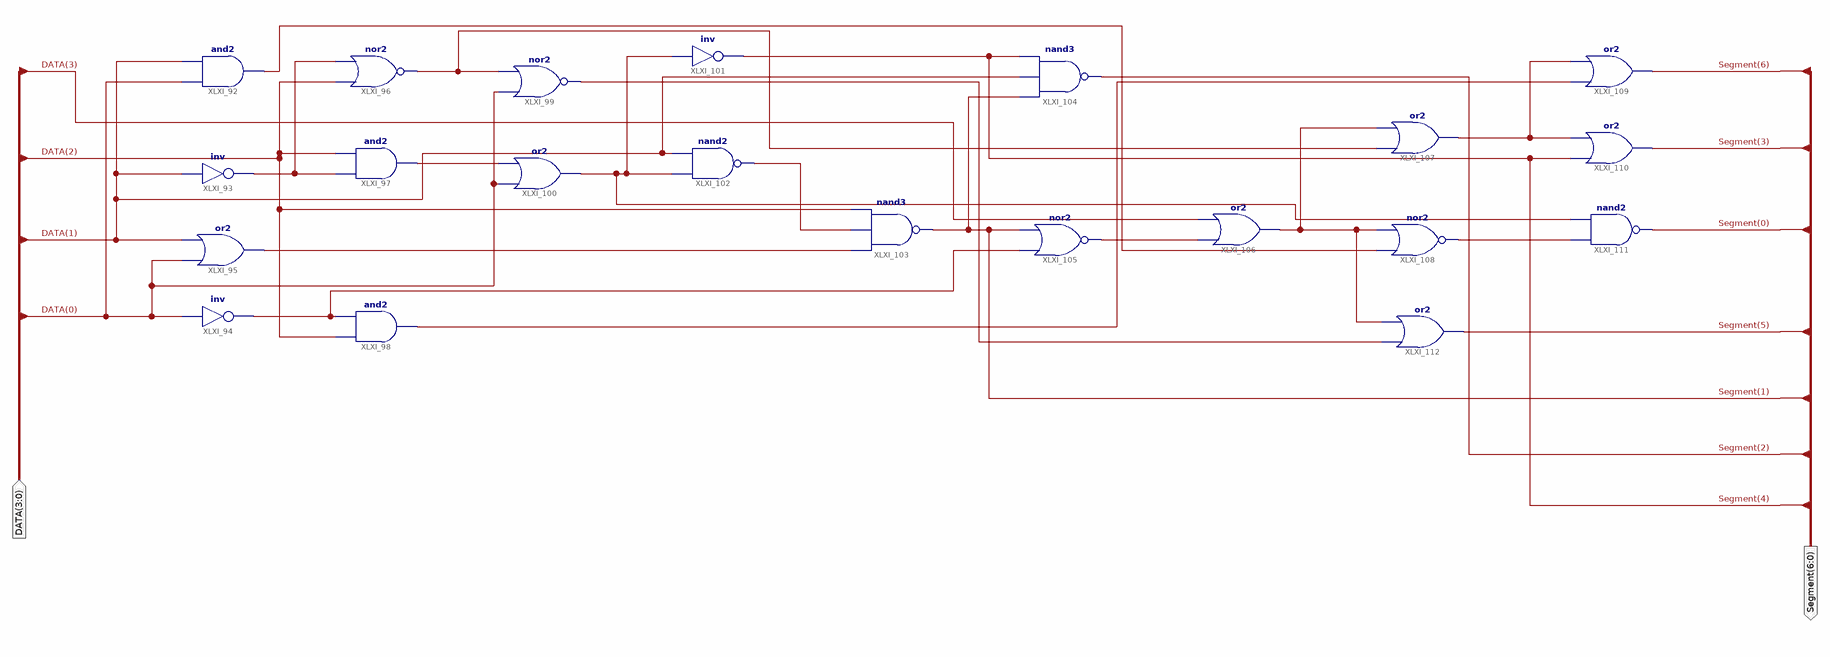
[diagram p0: schematic sheet 1]
// Xilinx ISE schematic ssd1d09b.sch (spartan6) as structural Verilog: 21 symbols, 2 ports
module ssd1d09b (
  input  [3:0] DATA,
  output [6:0] Segment
);

  wire XLXN_109, XLXN_111, XLXN_113, XLXN_114, XLXN_117, XLXN_118, XLXN_119, XLXN_125, XLXN_129, XLXN_130,
       XLXN_131, XLXN_132, XLXN_134, XLXN_135;

  and XLXI_92 (XLXN_129, DATA[0], DATA[1]);
  not XLXI_93 (XLXN_109, DATA[1]);
  not XLXI_94 (XLXN_111, DATA[0]);
  or XLXI_95 (XLXN_118, DATA[0], DATA[1]);
  nor XLXI_96 (XLXN_113, DATA[2], XLXN_109);
  and XLXI_97 (XLXN_114, XLXN_109, DATA[2]);
  and XLXI_98 (XLXN_135, DATA[2], XLXN_111);
  nor XLXI_99 (XLXN_131, DATA[0], XLXN_113);
  or XLXI_100 (XLXN_117, DATA[0], XLXN_114);
  not XLXI_101 (Segment[4], XLXN_117);
  nand XLXI_102 (XLXN_119, XLXN_117, DATA[1]);
  nand XLXI_103 (Segment[1], XLXN_118, XLXN_119, DATA[2]);
  nand XLXI_104 (Segment[2], Segment[1], DATA[1], Segment[4]);
  nor XLXI_105 (XLXN_125, XLXN_111, Segment[1]);
  or XLXI_106 (XLXN_130, XLXN_125, DATA[3]);
  or XLXI_107 (XLXN_134, XLXN_113, XLXN_130);
  nor XLXI_108 (XLXN_132, XLXN_129, XLXN_130);
  or XLXI_109 (Segment[6], XLXN_135, XLXN_134);
  or XLXI_110 (Segment[3], Segment[4], XLXN_134);
  nand XLXI_111 (Segment[0], XLXN_132, XLXN_117);
  or XLXI_112 (Segment[5], XLXN_131, XLXN_130);
endmodule
